# EAGLE design board (EAGLE 9.3.0)
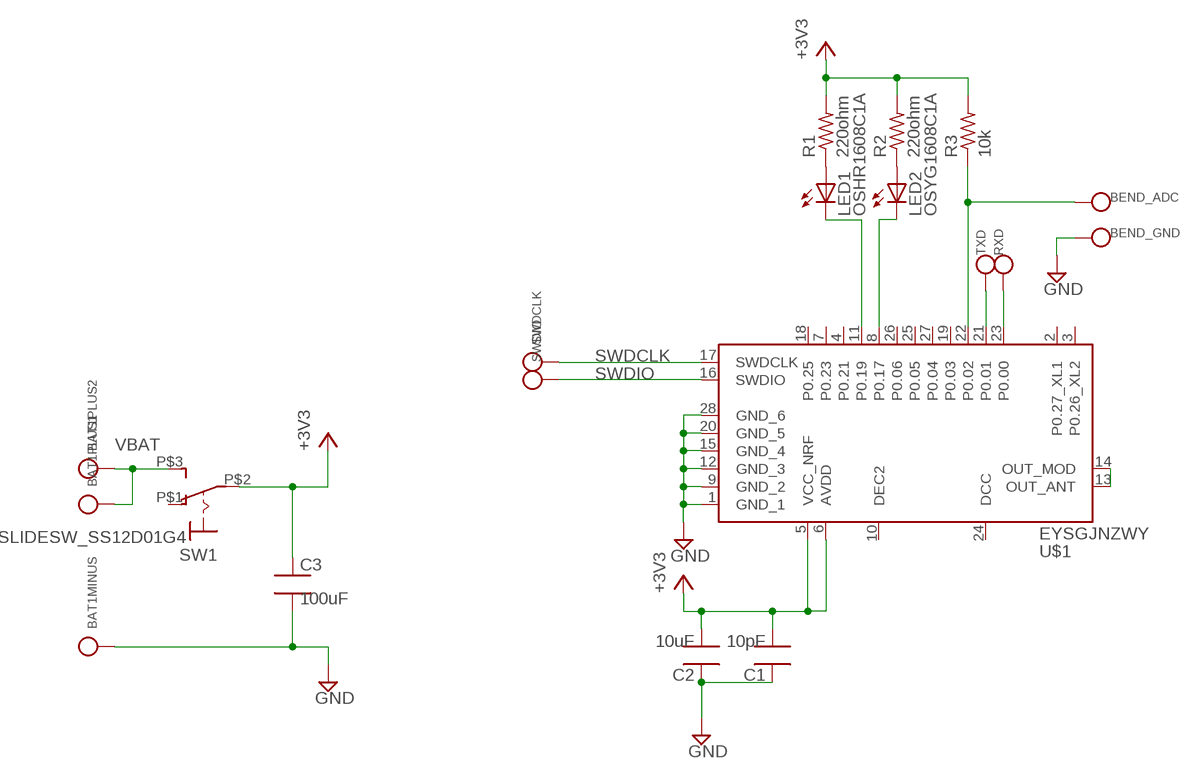
[diagram p0: schematic, sheet 1]

## Parts
BAT1  BATTERY  [CR1025]
BEND_ADC  CHECK_PIN-SMD_100*60  [SMD_100*60]
BEND_GND  CHECK_PIN-SMD_100*60  [SMD_100*60]
C1  10pF  C-1005  [1005]
C2  10uF  C-1005  [1005]
C3  100uF  C-3216  [3216]
LED1  OSHR1608C1A  [1608-LED]
LED2  OSYG1608C1A  [1608-LED]
R1  220ohm  R-1608  [1608]
R2  220ohm  R-1608  [1608]
R3  10k  R-1608  [1608]
RXD  CHECK_PIN-SMD_100*60  [SMD_100*60]
SW1  SLIDESW_SS12D01G4  [SS12D01G4]
SWDCLK  CHECK_PIN-SMD_100*60  [SMD_100*60]
SWDIO  CHECK_PIN-SMD_100*60  [SMD_100*60]
TXD  CHECK_PIN-SMD_100*60  [SMD_100*60]
U$1  EYSGJNZWY  [TAIYOYUDEN_BT_XXXXJN]

## Nets
+3V3: C1.2 C2.2 C3.1 R1.2 R2.2 R3.2 SW1.P$2(P) U$1.5(VCC_NRF) U$1.6(AVDD)
GND: BAT1.- BEND_GND.SIGNAL C1.1 C2.1 C3.2 U$1.1(GND_1) U$1.9(GND_2) U$1.12(GND_3) U$1.15(GND_4) U$1.20(GND_5) U$1.28(GND_6)
N$1: LED1.1(A) R1.1
N$2: LED2.1(A) R2.1
N$4: LED1.2(K) U$1.11(P0.19)
N$5: U$1.13(OUT_ANT) U$1.14(OUT_MOD)
N$6: LED2.2(K) U$1.8(P0.17)
N$11: BEND_ADC.SIGNAL R3.1 U$1.22(P0.02)
RXD: RXD.SIGNAL U$1.23(P0.00)
SWDCLK: SWDCLK.SIGNAL U$1.17(SWDCLK)
SWDIO: SWDIO.SIGNAL U$1.16(SWDIO)
TXD: TXD.SIGNAL U$1.21(P0.01)
VBAT: BAT1.+_1 BAT1.+_2 SW1.P$3(S)
Unconnected: SW1.P$1(O) U$1.2(P0.27_XL1) U$1.3(P0.26_XL2) U$1.4(P0.21) U$1.7(P0.23) U$1.10(DEC2) U$1.18(P0.25) U$1.19(P0.03) U$1.24(DCC) U$1.25(P0.05) U$1.26(P0.06) U$1.27(P0.04)

## Library data of the parts
BAT1 = mylibrary:BATTERY
BEND_ADC BEND_GND RXD SWDCLK SWDIO TXD = mylibrary:CHECK_PIN
C1-C3 = mylibrary:C
LED1 = mylibrary:OS*1608C1A: OSXX1608C1A Features: 1.6mm x 0.8mm x 0.6mm Vf @ 5mA Datasheet is avaliable here <http://akizukidenshi.com/download/ds/optosupply/OSXX1608C1A_ver_a_10.pdf>; AKIZUKI: Yes; COLOR: Red; VF: 1.9
LED2 = mylibrary:OS*1608C1A: OSXX1608C1A Features: 1.6mm x 0.8mm x 0.6mm Vf @ 5mA Datasheet is avaliable here <http://akizukidenshi.com/download/ds/optosupply/OSXX1608C1A_ver_a_10.pdf>; AKIZUKI: Yes; COLOR: Yellow green; VF: 1.9
R1-R3 = mylibrary:R
SW1 = mylibrary:SLIDESW: Slide Switch
U$1 = mylibrary:EYSGJNZ; RAM: 32KB; SOFTDEVICE: S120

## Board
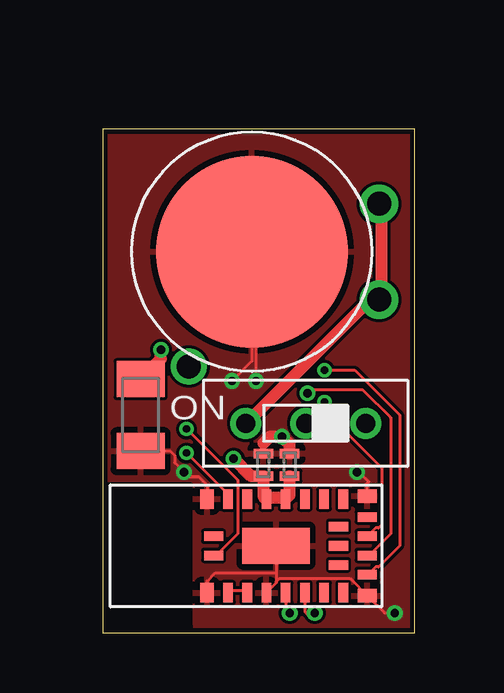
[diagram p1: board, top side]
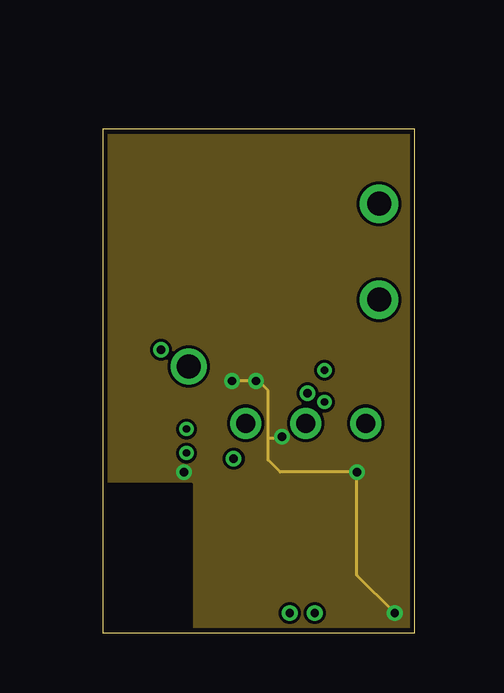
[diagram p2: board, inner layer Route2]
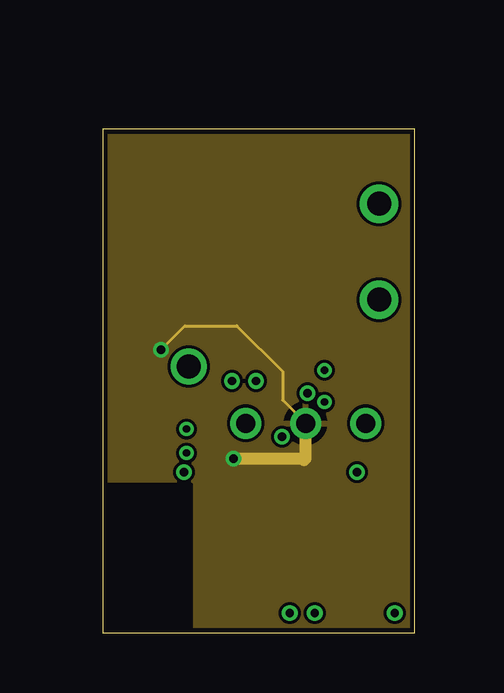
[diagram p3: board, inner layer Route15]
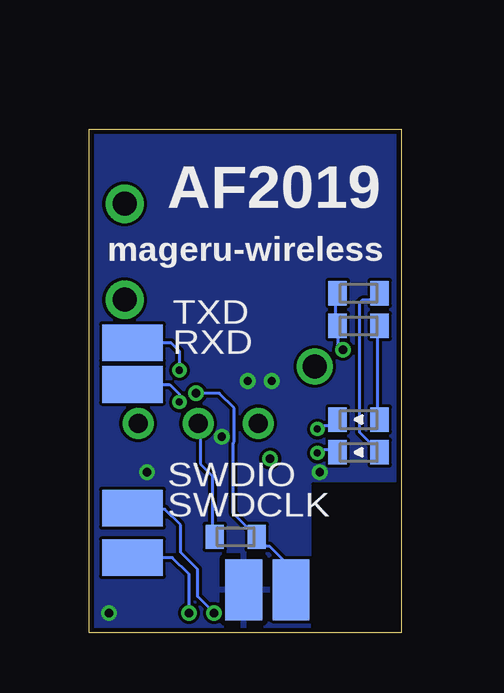
[diagram p4: board, bottom side, seen from below]

Size 13 x 21 mm. Coordinates in mm from the lower left corner, seen from the top.
Outline: 0,0 13,0 13,21 0,21 0,0
Copper layers (1+2*15+16): Top 0.035mm / dielectric 0.2mm / Route2 0.035mm / dielectric 1.03mm / Route15 0.035mm / dielectric 0.2mm / Bottom 0.035mm
Design rules "p_ban_4layer *": minimum track width 5mil, minimum drill 0.3mm, track to track 5mil, track to pad 5mil, pad to pad 5mil, via to via 5mil, smd to smd 5mil, copper to edge 0.2mm, drill to drill 0.3mm, minimum pad ring 0.15mm, minimum via ring 0.15mm, stop-mask expansion 4mil, vias tented up to drill 0.35mm, thermal gap 10mil

### Footprints (pad centres in the part's own frame; a part is rotated, then mirrored left to right if it is on the bottom)
CR1025 = drill 1 pad 1.6: +_1 -2,-5.3; +_2 2,-5.3 | smd 8 x 8: - 0,0
SMD_100*60 = smd 2.54 x 1.524: SIGNAL 0,0
1005 = smd 0.406 x 0.813: 1 -0.473,0; 2 0.473,0
3216 = smd 1.5 x 2: 1 -1.5,0; 2 1.5,0
1608-LED = smd 0.762 x 1.016: 1 -0.875,0; 2 0.875,0
1608 = smd 0.762 x 1.016: 1 -0.875,0; 2 0.875,0
SS12D01G4 = drill 0.8 pad 1.3: P$1 -2.5,0; P$2 0,0; P$3 2.5,0
TAIYOYUDEN_BT_XXXXJN = smd 0.8 x 0.55: 1 0.6,0.475; 20 0.6,4.625 | smd 0.4 x 0.8: 2 1.6,0.6; 3 2.4,0.6; 4 3.2,0.6; 5 4,0.6; 6 4.8,0.6; 7 5.6,0.6; 8 6.4,0.6; 13 6.4,4.5; 14 5.6,4.5; 15 4.8,4.5; 16 4,4.5; 17 3.2,4.5; 18 2.4,4.5; 19 1.6,4.5 | smd 0.55 x 0.8: 9 7.275,0.6; 12 7.275,4.5 | smd 0.8 x 0.4: 10 7,2.15; 11 7,2.95; 21 0.6,3.75; 22 0.6,2.95; 23 0.6,2.15; 24 0.6,1.35; 25 1.8,3.35; 26 1.8,2.55; 27 1.8,1.75 | smd 2.8 x 1.5: 28 4.4,2.55

### Placement (x,y rotation side)
BAT1  6.22,15.89 90 top
BEND_ADC  4.6,1.8 270 bottom
BEND_GND  6.57,1.8 90 bottom
C1  6.7,7 270 top
C2  7.8,7 270 top
C3  1.59,9.08 270 top
LED1  1.78,8.89 180 bottom
LED2  1.78,7.53 180 bottom
R1  1.78,12.79 180 bottom
R2  1.78,14.16 180 bottom
R3  6.9,4 180 bottom
RXD  11.2,10.35 180 bottom
SW1  8.46,8.73 180 top
SWDCLK  11.2,3.13 180 bottom
SWDIO  11.2,5.2 0 bottom
TXD  11.2,12.1 180 bottom
U$1  11.63,6.18 180 top

### Tracks (layer width: path | path; a pad name or v marks a point on that pad's centre or on a via)
+3V3  (via drill 0.35)
  Top 0.127: 1.62,10.62 C3.1 | 6.88,5.62 U$1.6 | 7.75,6.5 C2.2 | 7.75,5.62 U$1.5
  Top 0.5: 6.88,5.62 7.62,5.62 U$1.5 7.8,5.75 C2.2 | 6.75,5.62 U$1.6 6.7,5.71 C1.2 6.2,6.53 v5.46,7.26 | C3.1 2.43,11.43 v2.43,11.8
  Route15 0.127: 8.37,8.73 SW1.P$2 7.5,9.7 7.5,10.9 5.6,12.8 3.43,12.8 v2.43,11.8
  Route15 0.5: v5.46,7.26 8.34,7.26 8.4,7.2 8.46,7.26 SW1.P$2
  Bottom 0.127: R2.2 2.75,14.12 2.75,12.88 R1.2 2.65,12.02 v2.43,11.8 | R3.2 7.88,4 7.88,6.55 8.38,7.05 8.38,8.62 SW1.P$2
  pour Route15: 0,21 13,21 13,0 0,0
GND  (via drill 0.35)
  Top 0.127: v12.18,0.82 11.76,0.82 U$1.20 10.31,2.27 7.35,2.27 7.24,2.16 7.24,2.09 | v6.4,10.5 6.4,15.7 6.41,15.71 6.25,15.88 BAT1.- 6.22,11.32 v5.4,10.5 | U$1.1 11.03,6.23 11.1,6.3 10.7,6.7 v10.6,6.7 | U$1.15 7.24,2.09 | U$1.28 7.23,2.5 | 7.23,2.5 7.23,2.1 7.24,2.09 | U$1.12 4.36,2.15 4.7,2.5 7.23,2.5 | U$1.9 4.36,6.14 4,6.5 3.6,6.5 v3.4,6.7 3,7.1 3,7.4 2.82,7.58 C3.2 | C2.1 7.78,7.47
  Top 0.5: 7.78,7.47 7.78,7.88 v7.48,8.18 6.98,8.18 6.7,7.9
  Route2 0.127: 6.9,8.1 6.9,7.2 7.4,6.7 v10.6,6.7 10.6,2.4 v12.18,0.82 | 6.9,8.1 6.9,10.1 6.5,10.5 v6.4,10.5 v5.4,10.5 | v7.48,8.18 7.48,8.1 6.9,8.1
  Bottom 0.127: v5.4,10.5 5.5,10.4
  pour Route2: 0,21 0,0 13,0 13,21
  pour Bottom: 0,21 0,0 13,0 13,21
  pour Top: 0,21 0,0 13,0 13,21
N$1
  Bottom 0.127: LED1.1 1,9 1,12.75 R1.1
N$2
  Bottom 0.127: LED2.1 1,7.62 1.75,8.38 1.75,9.1 1.75,9.25 1.75,13.75 1.62,13.88 1.25,13.88 1,14.12 R2.1
N$3  (via drill 1)
  other vias: 3.6,11.1
N$4  (via drill 0.3)
  Top 0.127: v3.5,8.5 5.62,6.38 5.62,4.12 4.75,3.25 U$1.11
  Bottom 0.127: v3.5,8.5 3.38,8.62 3,8.62 2.75,8.88 LED1.2
N$5
  Top 0.127: U$1.13 5.25,1.75 6,1.75 U$1.14
N$6  (via drill 0.3)
  Top 0.127: v3.5,7.5 5.12,5.88 5.12,5.62 U$1.8
  Bottom 0.127: v3.5,7.5 3.38,7.62 2.75,7.62 LED2.2
N$7
  cutout Top: 3.6,6.2 0.3,6.2 0.3,0.3 3.7,0.3 3.7,6.2
N$8
  cutout Route2: 0.3,6.2 3.7,6.2 3.7,0.3 0.3,0.3
N$9
  cutout Route15: 0.3,6.2 3.7,6.2 3.7,0.3 0.3,0.3
N$10
  cutout Bottom: 0.3,6.2 3.7,6.2 3.7,0.3 0.3,0.3
N$11  (via drill 0.35)
  Top 0.127: U$1.22 11.12,3.25 12,4.12 12,8.97 10.85,10.12 8.62,10.12 8.62,10.06 v8.55,9.98
  Bottom 0.127: 6.12,4 R3.1 | BEND_ADC.SIGNAL 4.62,1.88 4.62,3 4.88,3 5.5,3.62 5.62,3.62 6,4 R3.1 | v8.55,9.98 7.58,9.98 6.97,9.37 6.97,7.97 7,7.93 7,4.97 R3.1
RXD  (via drill 0.3)
  Top 0.127: v9.25,9.62 9.25,9.25 11.62,6.88 11.62,4.5 11.5,4.38 11.38,4.38 11.12,4.12 U$1.23
  Bottom 0.127: RXD.SIGNAL 9.65,10.35 9.25,9.95 v9.25,9.62
SWDCLK  (via drill 0.35)
  Top 0.127: U$1.17 8.43,0.87 8.6,0.7 8.72,0.82 v8.84,0.82
  Bottom 0.127: v8.84,0.82 8.84,2.44 9.54,3.13 SWDCLK.SIGNAL
SWDIO  (via drill 0.35)
  Top 0.127: U$1.16 7.63,0.87 7.7,0.8 7.72,0.82 v7.8,0.82
  Bottom 0.127: SWDIO.SIGNAL 11.15,5.15 9.85,5.15 9.2,4.5 9.2,3.36 8.49,2.65 8.49,1.51 v7.8,0.82
TXD  (via drill 0.3)
  Top 0.127: v9.25,10.95 10.5,10.95 12.38,9.07 12.38,3.62 11.5,2.75 11.38,2.75 11.12,2.5 U$1.21
  Bottom 0.127: TXD.SIGNAL 9.6,12.1 9.25,11.75 v9.25,10.95
VBAT
  Top 0.127: 6,8.75 SW1.P$3 | 11.5,13.88 BAT1.+_1 | 11.62,17.88 BAT1.+_2
  Top 0.5: 6,8.75 11.12,13.88 11.5,13.88 | 11.62,17.88 11.62,14 BAT1.+_1

### Text on the board
tPlace: ON
bPlace: AF2019 | mageru-wireless